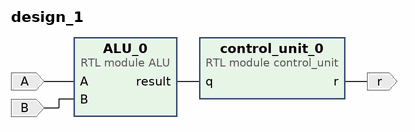
[diagram p0: block diagram of the top level]
# Vivado block design design_1, xc7a35tcpg236-1, Vivado 2017.3
create_bd_design design_1

create_bd_port -dir I A
create_bd_port -dir I B
create_bd_port -dir O r

create_bd_cell -type module -reference control_unit control_unit_0
create_bd_cell -type module -reference ALU ALU_0

# ---- connections ----

connect_bd_net [get_bd_pins ALU_0/result] [get_bd_pins control_unit_0/q]
connect_bd_net [get_bd_ports A] [get_bd_pins ALU_0/A]
connect_bd_net [get_bd_ports B] [get_bd_pins ALU_0/B]
connect_bd_net [get_bd_pins control_unit_0/r] [get_bd_ports r]

validate_bd_design
save_bd_design
